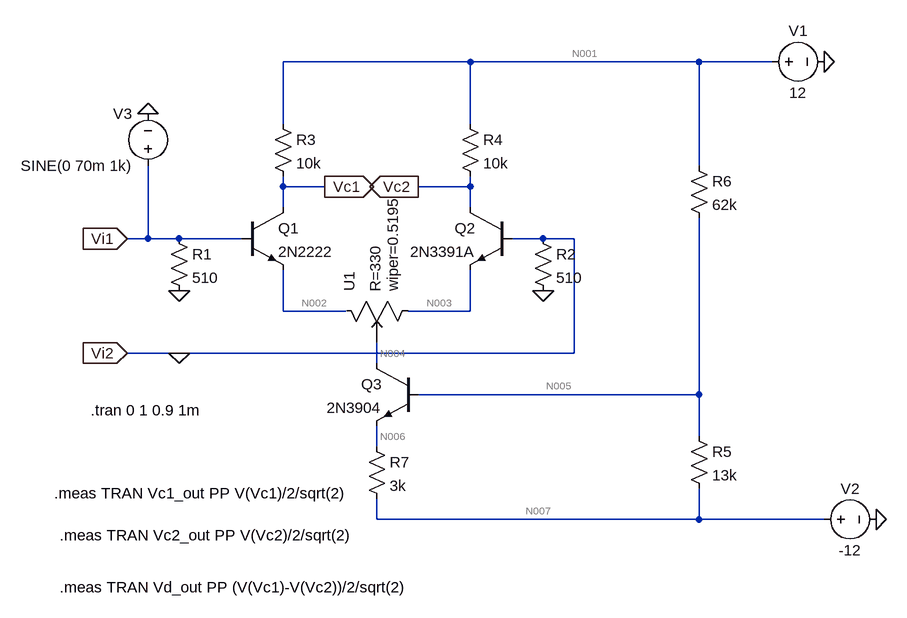
[diagram p0: schematic DifferentialAmplifierCircuit_single_sin_input.asc]
DifferentialAmplifierCircuit_single_sin_input.asc, the LTspice schematic file:
Version 4.1
SHEET 1 880 680
WIRE -448 -192 -736 -192
WIRE -96 -192 -448 -192
WIRE 16 -192 -96 -192
WIRE -736 -96 -736 -192
WIRE -448 -96 -448 -192
WIRE -96 -32 -96 -192
WIRE -736 0 -736 -16
WIRE -672 0 -736 0
WIRE -448 0 -448 -16
WIRE -448 0 -528 0
WIRE -736 32 -736 0
WIRE -448 32 -448 0
WIRE -944 80 -944 -32
WIRE -944 80 -976 80
WIRE -896 80 -944 80
WIRE -800 80 -896 80
WIRE -336 80 -384 80
WIRE -288 80 -336 80
WIRE -736 192 -736 128
WIRE -640 192 -736 192
WIRE -448 192 -448 128
WIRE -448 192 -544 192
WIRE -896 256 -976 256
WIRE -288 256 -288 80
WIRE -288 256 -896 256
WIRE -592 272 -592 240
WIRE -96 320 -96 48
WIRE -96 320 -528 320
WIRE -96 384 -96 320
WIRE -592 400 -592 368
WIRE -592 512 -592 480
WIRE -96 512 -96 464
WIRE -96 512 -592 512
WIRE 96 512 -96 512
FLAG -896 160 0
FLAG -336 160 0
FLAG -976 80 Vi1
IOPIN -976 80 In
FLAG -976 256 Vi2
IOPIN -976 256 In
FLAG -672 0 Vc1
IOPIN -672 0 Out
FLAG -528 0 Vc2
IOPIN -528 0 Out
FLAG 96 -192 0
FLAG 176 512 0
FLAG -944 -112 0
FLAG -896 256 0
SYMBOL npn -800 32 R0
SYMATTR InstName Q1
SYMATTR Value 2N2222
SYMBOL npn -384 32 M0
SYMATTR InstName Q2
SYMATTR Value 2N3391A
SYMBOL npn -528 272 M0
SYMATTR InstName Q3
SYMATTR Value 2N3904
SYMBOL res -912 64 R0
SYMATTR InstName R1
SYMATTR Value 510
SYMBOL res -352 64 R0
SYMATTR InstName R2
SYMATTR Value 510
SYMBOL res -752 -112 R0
SYMATTR InstName R3
SYMATTR Value 10k
SYMBOL res -464 -112 R0
SYMATTR InstName R4
SYMATTR Value 10k
SYMBOL res -112 368 R0
SYMATTR InstName R5
SYMATTR Value 13k
SYMBOL res -112 -48 R0
SYMATTR InstName R6
SYMATTR Value 62k
SYMBOL res -608 384 R0
SYMATTR InstName R7
SYMATTR Value 3k
SYMBOL voltage 0 -192 R270
WINDOW 0 32 56 VTop 2
WINDOW 3 -32 56 VBottom 2
WINDOW 123 0 0 Left 0
WINDOW 39 0 0 Left 0
SYMATTR InstName V1
SYMATTR Value 12
SYMBOL voltage 80 512 R270
WINDOW 0 32 56 VTop 2
WINDOW 3 -32 56 VBottom 2
WINDOW 123 0 0 Left 0
WINDOW 39 0 0 Left 0
SYMATTR InstName V2
SYMATTR Value -12
SYMBOL potentiometer -544 192 R270
SYMATTR InstName U1
SYMATTR SpiceLine R=330
SYMATTR SpiceLine2 wiper=0.5195
SYMBOL voltage -944 -16 R180
WINDOW 0 24 96 Left 2
WINDOW 3 24 16 Left 2
WINDOW 123 0 0 Left 0
WINDOW 39 0 0 Left 0
SYMATTR InstName V3
SYMATTR Value SINE(0 70m 1k)
TEXT -1032 344 Left 2 !.tran 0 1 0.9 1m
TEXT -1088 472 Left 2 !.meas TRAN Vc1_out PP V(Vc1)/2/sqrt(2)
TEXT -1080 536 Left 2 !.meas TRAN Vc2_out PP V(Vc2)/2/sqrt(2)
TEXT -1080 616 Left 2 !.meas TRAN Vd_out PP (V(Vc1)-V(Vc2))/2/sqrt(2)

The netlist it stands for:
* DifferentialAmplifierCircuit_single_sin_input.asc
Q1 Vc1 Vi1 N002 0 2N2222
Q2 Vc2 0 N003 0 2N3391A
Q3 N004 N005 N006 0 2N3904
R1 Vi1 0 510
R2 0 0 510
R3 N001 Vc1 10k
R4 N001 Vc2 10k
R5 N005 N007 13k
R6 N001 N005 62k
R7 N006 N007 3k
V1 N001 0 12
V2 N007 0 -12
X§U1 N002 N003 N004 potentiometer R=330 wiper=0.5195  ; pins 1 2 3
V3 Vi1 0 SINE(0 70m 1k)
.model NPN NPN
.model PNP PNP
.lib standard.bjt
.tran 0 1 0.9 1m
.meas TRAN Vc1_out PP V(Vc1)/2/sqrt(2)
.meas TRAN Vc2_out PP V(Vc2)/2/sqrt(2)
.meas TRAN Vd_out PP (V(Vc1)-V(Vc2))/2/sqrt(2)
.lib potentiometer.lib
.backanno
.end

* Results of the author's LTspice run, read from the files saved beside the schematic
* Operating Point, zero values left out:
*   V(vc2) = 6.267 V
*   V(n003) = -632.1 mV
*   V(n005) = -7.879 V
*   V(n007) = -12 V
*   V(vc1) = 6.267 V
*   V(n002) = -639.3 mV
*   V(n004) = -730.7 mV
*   V(n006) = -8.536 V
*   V(n001) = 12 V
*   Ic(Q1) = 573.3 µA
*   Ib(Q1) = 2.702 µA
*   Ie(Q1) = -576 µA
*   I(R3) = 573.3 µA
*   I(R5) = 317 µA
*   I(V1) = -1.467 mA
*   Ic(Q3) = 1.151 mA
*   Ib(Q3) = 3.591 µA
*   Ie(Q3) = -1.155 mA
*   Ic(Q2) = 573.3 µA
*   Ib(Q2) = 1.869 µA
*   Ie(Q2) = -575.2 µA
*   I(R4) = 573.3 µA
*   I(R6) = 320.6 µA
*   I(R7) = 1.155 mA
*   I(V2) = 1.472 mA
*   I(V3) = -2.702 µA
*   Ix(u1:1) = 576 µA
*   Ix(u1:2) = 575.2 µA
*   Ix(u1:3) = -1.151 mA
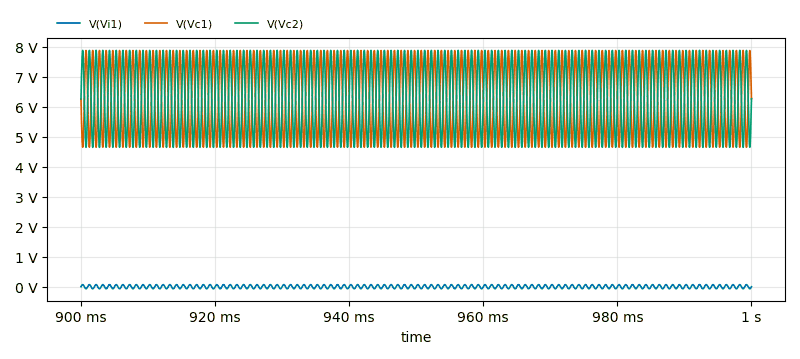
[diagram p1: Transient Analysis of DifferentialAmplifierCircuit_single_sin_input.asc, plotted from the saved traces]
* Transient Analysis, 1 run:
*   V(Vi1): min -70 mV, max 70 mV, average 935.7 nV, rms 50.35 mV, last 0 V
*   V(Vc1): min 4.652 V, max 7.882 V, average 6.267 V, rms 6.374 V, last 6.268 V
*   V(Vc2): min 4.65 V, max 7.885 V, average 6.267 V, rms 6.375 V, last 6.267 V
* From the log:
*   vc1_out: PP(V(Vc1)/2/sqrt(2))=1.1416519161 FROM 0 TO 0.1
*   vc2_out: PP(V(Vc2)/2/sqrt(2))=1.14384018048 FROM 0 TO 0.1
*   vd_out: PP(V(Vc1)-V(Vc2))/2/sqrt(2)=2.28549209658 FROM 0 TO 0.1